# EAGLE design power (EAGLE 7.2.0)
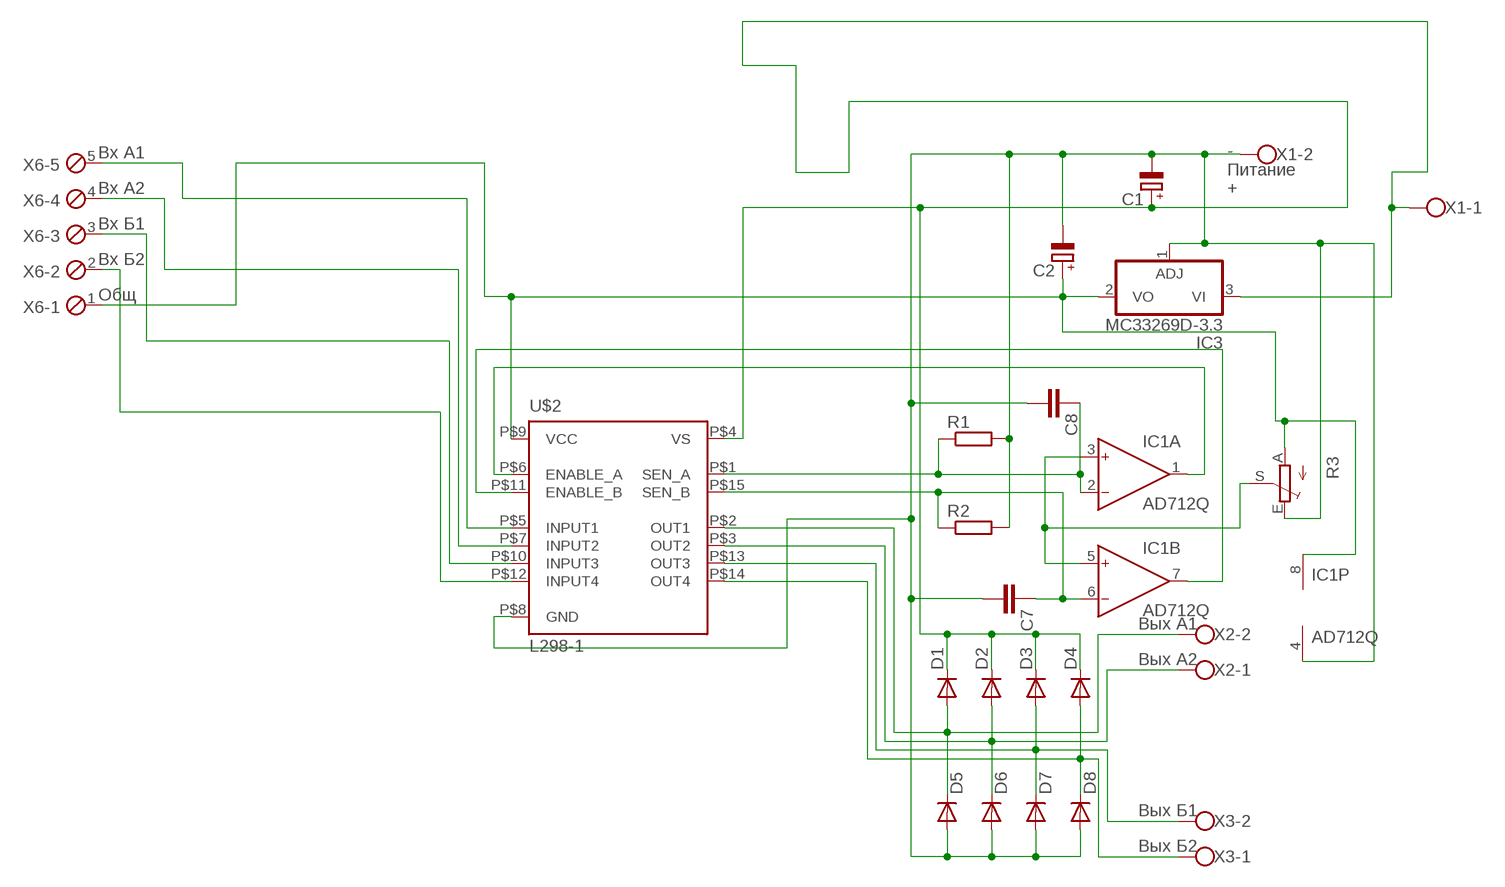
[diagram p0: schematic, sheet 1]

## Parts
C1  CPOL-EUE2,5-6E  [E2,5-6E]
C2  CPOL-EUE2,5-6E  [E2,5-6E]
C7  C-EUC1206  [C1206]
C8  C-EUC1206  [C1206]
D1  DIODE-C1702-05  [C1702-05]
D2  DIODE-C1702-05  [C1702-05]
D3  DIODE-C1702-05  [C1702-05]
D4  DIODE-C1702-05  [C1702-05]
D5  DIODE-C1702-05  [C1702-05]
D6  DIODE-C1702-05  [C1702-05]
D7  DIODE-C1702-05  [C1702-05]
D8  DIODE-C1702-05  [C1702-05]
IC1  AD712Q  [DIL08]
IC3  MC33269D-3.3  [DPACK]
R1  R-EU_VTA52  [VTA52]
R2  R-EU_VTA52  [VTA52]
R3  TRIM_EU-S75H  [S75H]
U$2  L298-1  [MULTIWATT-15-1]
X1  W237-102  [W237-102]
X2  W237-102  [W237-102]
X3  W237-102  [W237-102]
X6  MPT5  [5POL254]

## Nets
N$1: C1.- C2.- C7.2 C8.2 D5.A D6.A D7.A D8.A IC1.4(P:V-) IC3.1(ADJ) R1.2 R2.2 R3.E U$2.P$8(GND) X1.2
N$2: D2.A D6.C U$2.P$3(OUT2) X2.1
N$3: C2.+ IC1.8(P:V+) IC3.2(VO) R3.A U$2.P$9(VCC) X6.1
N$4: C8.1 IC1.2(A:IN-) R1.1 U$2.P$1(SEN_A)
N$5: C7.1 IC1.6(B:IN-) R2.1 U$2.P$15(SEN_B)
N$6: IC1.3(A:IN+) IC1.5(B:IN+) R3.S
N$7: IC1.1(A:OUT) U$2.P$6(ENABLE_A)
N$8: IC1.7(B:OUT) U$2.P$11(ENABLE_B)
N$9: D4.A D8.C U$2.P$14(OUT4) X3.1
N$11: D3.A D7.C U$2.P$13(OUT3) X3.2
N$12: D1.A D5.C U$2.P$2(OUT1) X2.2
N$13: U$2.P$5(INPUT1) X6.5
N$14: U$2.P$7(INPUT2) X6.4
N$15: U$2.P$10(INPUT3) X6.3
N$16: U$2.P$12(INPUT4) X6.2
N$20: C1.+ D1.C D2.C D3.C D4.C IC3.3(VI) U$2.P$4(VS) X1.1

## Notes on the sheet
- Вх А1
- Вх А2
- -
  Питание
  +
- Вх Б1
- Вх Б2
- Общ
- Вых А1
- Вых А2
- Вых Б1
- Вых Б2

## Library data of the parts
C1 C2 = resistor:CPOL-EU: POLARIZED CAPACITOR, European symbol
C7 C8 = resistor:C-EU: CAPACITOR, European symbol
D1-D8 = diode:DIODE-: DIODE
IC1 = analog-devices:AD712: Dual Precision, Low Cost, High Speed BiFET Op Amp Source: http://www.analog.com/static/imported-files/data_sheets/AD712.pdf; MF: ALTERA CORPORATION; MPN: AD712AQ; OC_FARNELL: 9604898; OC_NEWARK: 05F7274
IC3 = linear:MC33269?*: Adjustable Output Low Dropout Voltage Regulator 800 mA Source: http://www.onsemi.com/pub/Collateral/MC33269-D.PDF
R1 R2 = rcl:R-EU_: RESISTOR, European symbol
R3 = pot:TRIM_EU-: POTENTIOMETER
U$2 = st-microelectronics:L298-1: L298 alternative place package (half-SMD)
X1-X3 = con-wago-500:W237-102: WAGO SCREW CLAMP; MPN: 237-102; OC_FARNELL: unknown; OC_NEWARK: 70K9898
X6 = con-phoenix-254:MPT5: PHOENIX CONNECTOR; OC_FARNELL: unknown; OC_NEWARK: unknown

## Board
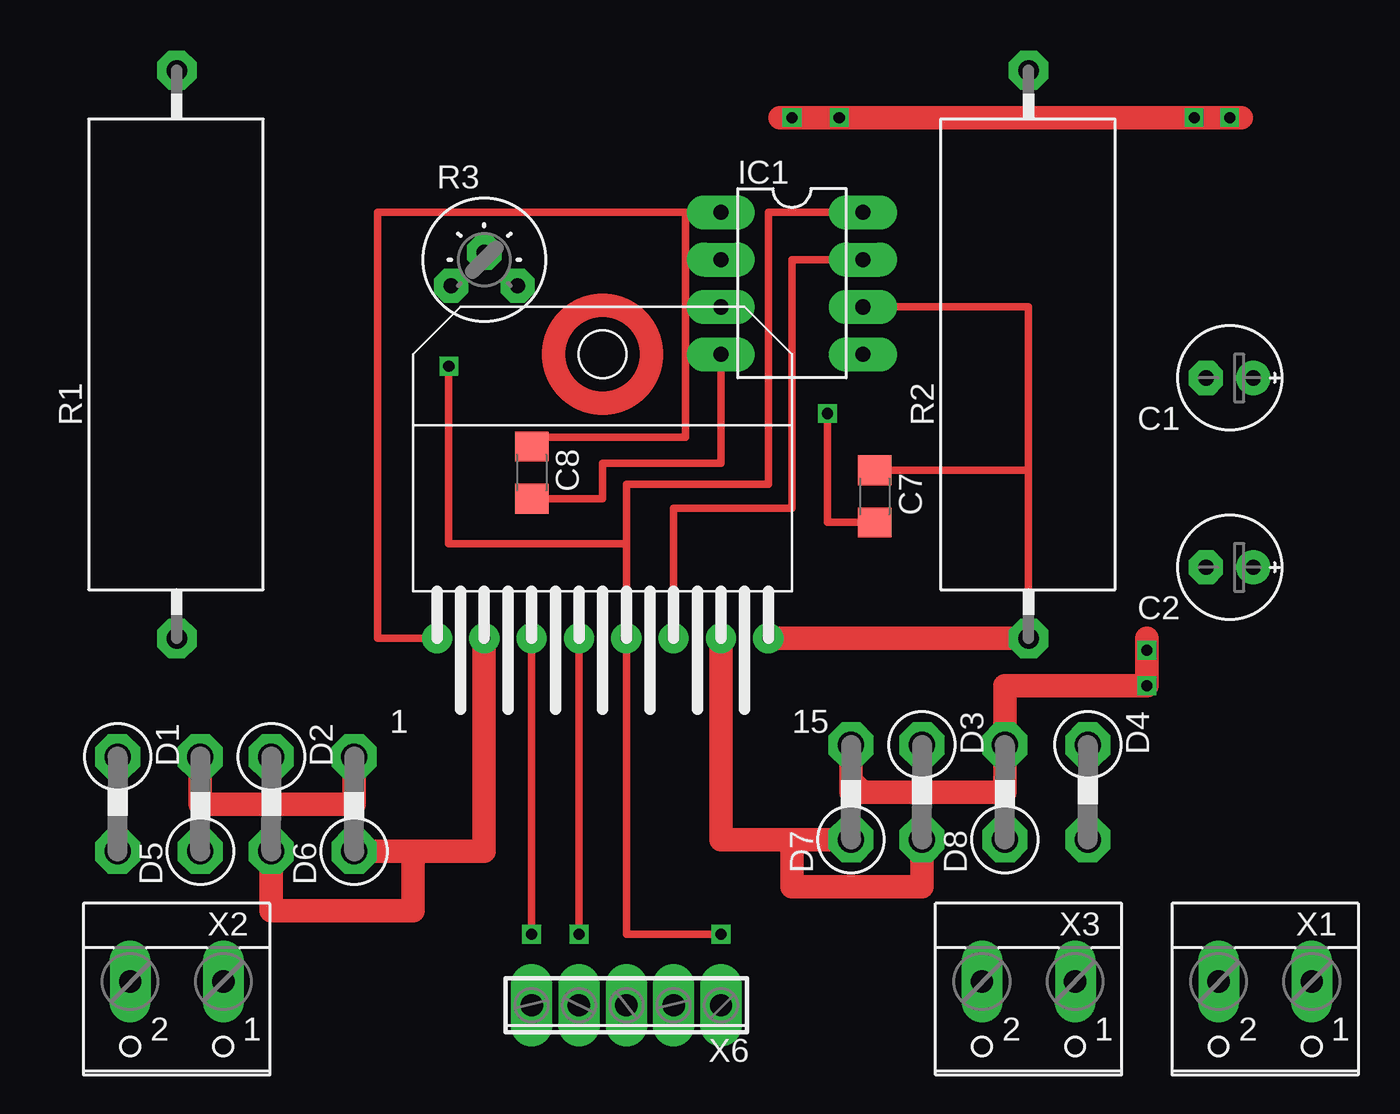
[diagram p1: board, top side]
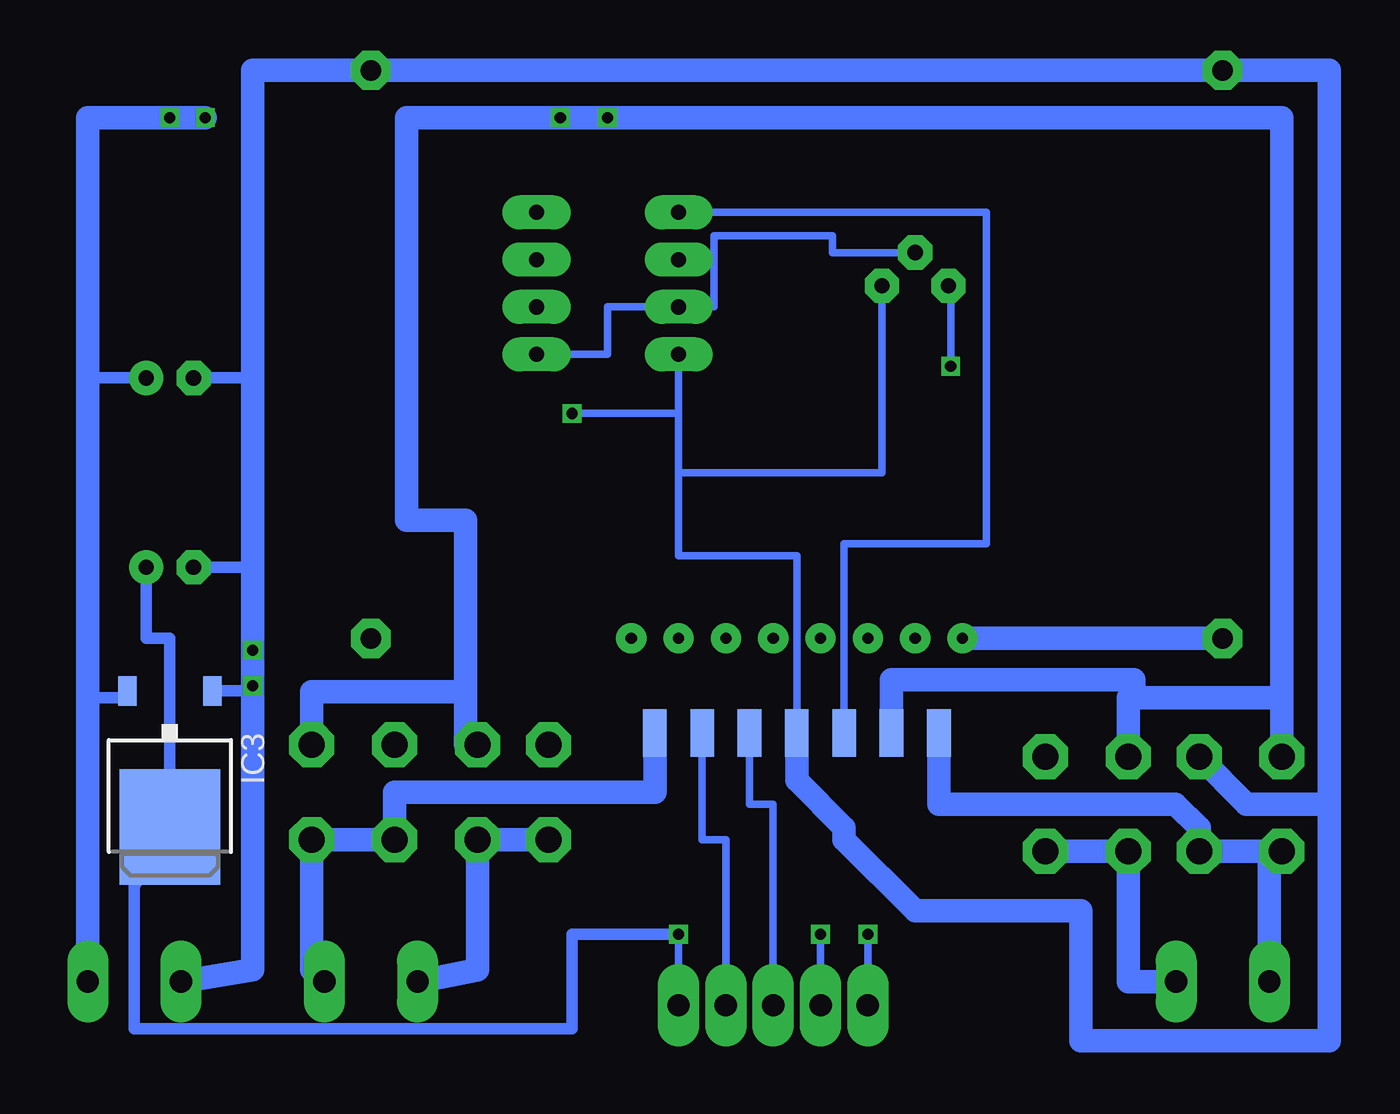
[diagram p2: board, bottom side, seen from below]

No outline drawn. Coordinates in mm, seen from the top.
Copper layers (1*16): Top 0.035mm / dielectric 1.5mm / Bottom 0.035mm
Design rules "default *": minimum track width 10mil, minimum drill 24mil, track to track 8mil, track to pad 8mil, pad to pad 8mil, via to via 8mil, smd to smd 8mil, copper to edge 40mil, drill to drill 8mil, minimum pad ring 20mil, minimum via ring 8mil, stop-mask expansion 4mil, vias tented up to drill 0mil, thermal gap 10mil

### Footprints (pad centres in the part's own frame; a part is rotated, then mirrored left to right if it is on the bottom)
E2,5-6E = drill 0.813 pad 1.575: + -1.27,0 | drill 0.813 pad 1.575 octagon: - 1.27,0
C1206 = smd 1.6 x 1.8: 1 -1.4,0; 2 1.4,0
C1702-05 = drill 1.397 octagon: A 2.54,0; C -2.54,0
DIL08 = drill 0.813 long: 1 -3.81,-3.81; 2 -1.27,-3.81; 3 1.27,-3.81; 4 3.81,-3.81; 5 3.81,3.81; 6 1.27,3.81; 7 -1.27,3.81; 8 -3.81,3.81
DPACK = smd 1 x 1.6: 1 -2.28,-4.8; 3 2.28,-4.8 | smd 5.4 x 6.2: 2 0,2.5
VTA52 = drill 1.1 octagon: 1 -15.24,0; 2 15.24,0
S75H = drill 0.813 octagon: A -1.778,-1.397; E 1.778,-1.397; S 0,0.381
MULTIWATT-15-1 = drill 0.6 pad 1.27: P$1 -15.24,6.35; P$3 -12.7,6.35; P$5 -10.16,6.35; P$7 -7.62,6.35; P$9 -5.08,6.35; P$11 -2.54,6.35; P$13 0,6.35; P$15 2.54,6.35 | smd 1.27 x 2.54 bottom: P$2 -13.97,1.27; P$4 -11.43,1.27; P$6 -8.89,1.27; P$8 -6.35,1.27; P$10 -3.81,1.27; P$12 -1.27,1.27; P$14 1.27,1.27
W237-102 = drill 1.194 long: 1 -2.5,-1.27; 2 2.5,-1.27
5POL254 = drill 1.2 long: 1 -5.08,0; 2 -2.54,0; 3 0,0; 4 2.54,0; 5 5.08,0

### Placement (x,y rotation side)
C1  62.23,37.47 180 top
C2  62.23,27.3 180 top
C7  43.18,31.11 270 top
C8  24.77,32.38 270 top
D1  2.54,14.61 270 top
D2  10.79,14.61 270 top
D3  45.72,15.24 270 top
D4  54.61,15.24 270 top
D5  6.99,14.61 90 top
D6  15.24,14.61 90 top
D7  41.91,15.24 90 top
D8  50.16,15.24 90 top
IC1  38.73,42.55 270 top
IC3  62.23,15.88 180 bottom
R1  5.71,38.73 90 top
R2  51.44,38.73 90 top
R3  22.23,43.81 0 top
U$2  34.92,17.14 0 top
X1  64.14,3.81 180 top
X2  5.71,3.81 180 top
X3  51.44,3.81 180 top
X6  29.84,3.81 180 top

### Tracks (layer width: path | path; a pad name or v marks a point on that pad's centre or on a via)
N$1  (via drill 0.6)
  Top 0.406: C8.2 28.57,30.98 28.57,32.89 34.92,32.89 IC1.4 | C7.2 40.64,29.71 v40.64,35.56
  Top 1.27: D6.A 15.24,14.61 6.99,14.61 D5.A | 42.55,15.24 41.91,15.24 D7.A 41.91,15.88 42.55,15.24 | 42.55,15.24 50.16,15.24 D8.A 50.16,20.95 v57.78,20.95 v57.78,22.86 57.78,23.5
  Bottom 0.406: IC1.4 34.92,35.56 | 34.92,35.56 34.92,32.38 | 34.92,32.38 34.92,27.94 28.57,27.94 U$2.P$8 | v40.64,35.56 34.92,35.56 | R3.E 24,32.38 34.92,32.38
  Bottom 0.61: 57.78,20.68 IC3.1 | C2.- 57.78,27.3 | C1.- 57.78,37.47
  Bottom 1.27: U$2.P$8 28.57,15.88 26.04,13.34 26.04,12.7 22.23,8.89 13.34,8.89 13.34,1.91 0,1.91 0,14.61 | 0,14.61 0,53.98 R1.2 R2.2 57.78,53.98 57.78,37.47 57.78,27.3 v57.78,22.86 v57.78,20.95 57.78,20.68 57.78,5.71 X1.2 | D5.A 4.45,14.61 0,14.61
  other vias: 50.16,17.78 6.99,17.14
N$2
  Top 1.27: D6.C 18.41,12.06 | 18.41,12.06 22.23,12.06 U$2.P$3 | 18.41,12.06 18.41,8.89 10.79,8.89 D2.A
  Bottom 1.27: D6.C D2.A 10.79,5.08 X2.1
N$3  (via drill 0.6)
  Top 0.406: IC1.8 37.47,46.35 37.47,31.75 29.84,31.75 29.84,28.57 | 29.84,28.57 U$2.P$9 29.84,7.62 v34.92,7.62 | 29.84,28.57 20.32,28.57 v20.32,38.1
  Bottom 0.406: X6.1 v34.92,7.62 | v20.32,38.1 20.32,42.42 R3.A
  Bottom 0.61: v34.92,7.62 40.64,7.62 40.64,2.54 64.14,2.54 64.14,10.16 IC3.2 | 64.14,13.97 IC3.2 | C2.+ 63.5,23.5 62.23,23.5 IC3.2
N$4
  Top 0.406: IC1.2 33.02,43.81 | 33.02,43.81 33.02,46.35 16.51,46.35 16.51,23.5 U$2.P$1 | 33.02,43.81 33.02,34.29 24.77,34.29 C8.1
  Bottom 1.27: R1.1 U$2.P$1
N$5
  Top 0.406: IC1.6 51.44,41.27 51.44,32.52 | R2.1 51.44,32.38 51.44,32.52 | C7.1 51.44,32.52
  Top 1.27: R2.1 U$2.P$15
N$6
  Bottom 0.406: IC1.5 38.73,38.73 38.73,41.27 IC1.3 33.02,41.27 33.02,45.09 26.67,45.09 26.67,44.2 R3.S
N$7
  Bottom 0.406: IC1.1 18.41,46.35 18.41,28.57 26.04,28.57 U$2.P$6
N$8
  Top 0.406: IC1.7 38.73,43.81 38.73,30.48 32.38,30.48 U$2.P$11
N$9
  Bottom 1.27: X3.1 54.61,5.71 D4.A D8.C 50.16,15.24 36.2,15.24 U$2.P$14
N$11
  Top 1.27: D7.C 38.73,12.7 | 38.73,12.7 34.92,12.7 U$2.P$13 | 38.73,12.7 38.73,10.16 45.72,10.16 D3.A
  Bottom 1.27: D7.C D3.A 45.72,5.71 X3.2
N$12
  Bottom 1.27: 3.21,12.06 D5.C 6.99,13.34 8.26,14.61 20.95,14.61 U$2.P$2 | 3.21,12.06 D1.A | X2.2 3.21,12.06
N$13  (via drill 0.6)
  Top 0.406: U$2.P$5 v24.77,7.62
  Bottom 0.406: v24.77,7.62 X6.5
N$14  (via drill 0.6)
  Top 0.406: U$2.P$7 v27.3,7.62
  Bottom 0.406: v27.3,7.62 X6.4
N$15
  Bottom 0.406: U$2.P$10 31.11,14.61 29.84,14.61 X6.3
N$16
  Bottom 0.406: U$2.P$12 33.66,12.7 32.38,12.7 X6.2
N$20  (via drill 0.6)
  Top 1.27: 62.87,51.44 v62.23,51.44 v60.33,51.44 v41.27,51.44 v38.73,51.44 38.1,51.44
  Bottom 0.61: IC3.3 64.51,20.32 66.64,20.32 | C1.+ 66.64,37.47
  Bottom 1.27: 66.64,6.35 X1.1 66.64,20.32 66.64,37.47 66.64,51.44 v62.23,51.44 v60.33,51.44 | D2.C 10.79,20.32 10.48,20.32 | 10.48,20.32 2.54,20.32 | 2.54,20.32 2.54,51.44 v38.73,51.44 v41.27,51.44 49.53,51.44 49.53,29.84 46.35,29.84 46.35,20.64 | D3.C 46.35,17.78 46.35,20.64 | U$2.P$4 23.5,21.27 10.48,21.27 10.48,20.32 | 2.54,20.32 D1.C | D4.C 54.61,20.64 46.35,20.64
(copper drawn outside any net)
  shapes: Top circle x1